# Altium schematic sheet Shoot.SchDoc
size A
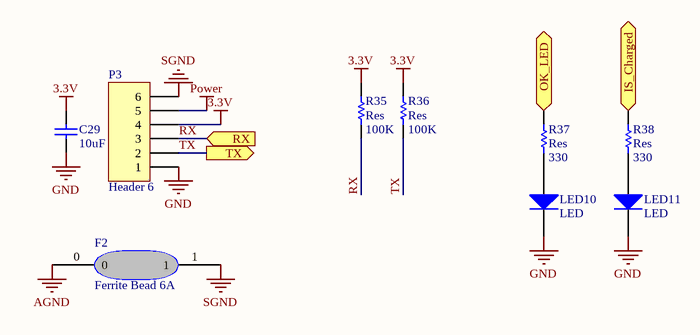
[diagram p0: Shoot.SchDoc]

## Parts
C29  value 10uF  [2012[0805]]  (hidden comment: Cap_UP)
F2  Ferrite Bead 6A  [f6A]
LED10  LED  [2012[0805]]
LED11  LED  [2012[0805]]
P3  Header 6  [HDR1X6]
R35  Res  value 100K  [2012[0805]]
R36  Res  value 100K  [2012[0805]]
R37  Res  value 330  [2012[0805]]
R38  Res  value 330  [2012[0805]]

## Ports
IS_Charged (in), OK_LED (in), RX (in), TX (out)

## Nets
3.3V: C29.2 P3.4 R35.2 R36.2
AGND: F2.0
GND: C29.1 LED10.2(K) LED11.2(K) P3.1
Power: P3.5
SGND: F2.1 P3.6
IS_Charged: R38.1 ; port IS_Charged
OK_LED: R37.1 ; port OK_LED
RX: P3.3 R35.1 ; port RX
TX: P3.2 R36.1 ; port TX
NetLED10_1: LED10.1(A) R37.2
NetLED11_1: LED11.1(A) R38.2

## Library data of the parts
C29 = Cap_UP: Capacitor; Published: 8-Jun-2000; LatestRevisionDate: 17-Jul-2002; LatestRevisionNote: Re-released for DXP Platform.; PackageReference: RAD-0.3; Publisher: Altium Limited
F2 = F6A
LED10 LED11 = Diode: 1 Amp General Purpose Rectifier; Revision 1: 11-Jul-2000: SIM Model Added.; Revision 2: 17-Jul-2002: Re-released for DXP Platform.; Package Information: Latest Revision: Aug-1999; Code - JEDEC: DO-204-AL; Published: 8-Jun-2000; Datasheet: Latest Revision: 1998; Package Reference: DO-41; Publisher: Altium Limited
P3 = Header 6: Header, 6-Pin; LatestRevisionDate: 17-Jul-2002; LatestRevisionNote: Re-released for DXP Platform.; Publisher: Altium Limited
R35-R38 = Res: Semiconductor Resistor; Published: 8-Jun-2000; LatestRevisionDate: 17-Jul-2002; LatestRevisionNote: Re-released for DXP Platform.; PackageReference: AXIAL-0.5; Publisher: Altium Limited